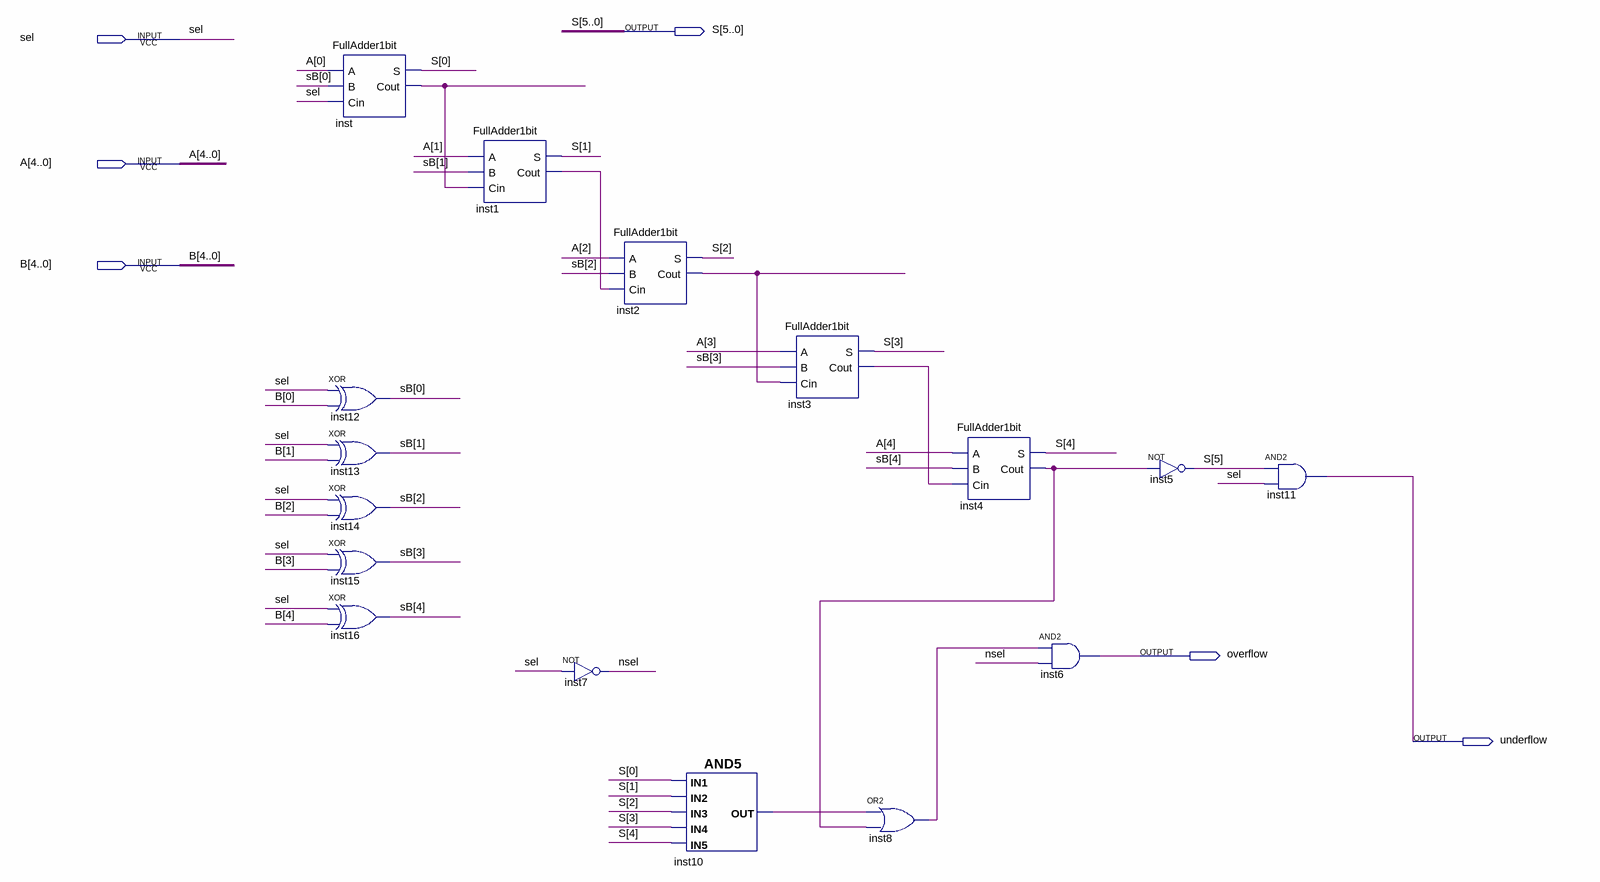
[diagram p0: schematic sheet]
// Quartus schematic add_sub5bit.bdf as structural Verilog: 16 symbols, 6 pins
module add_sub5bit (
  input  sel,
  input  [4:0] A,
  input  [4:0] B,
  output [5:0] S,
  output overflow,
  output underflow
);

  wire inst1_cout, inst2_cout, inst3_cout, inst4_cout, inst8_out, inst10_out, inst_cout, nsel;
  wire [4:0] sB;

  FullAdder1bit inst (.A(A[0]), .B(sB[0]), .Cin(sel), .S(S[0]), .Cout(inst_cout));
  xor inst12 (sB[0], sel, B[0]);
  xor inst13 (sB[1], sel, B[1]);
  xor inst14 (sB[2], sel, B[2]);
  xor inst15 (sB[3], sel, B[3]);
  xor inst16 (sB[4], sel, B[4]);
  FullAdder1bit inst1 (.A(A[1]), .B(sB[1]), .Cin(inst_cout), .S(S[1]), .Cout(inst1_cout));
  not inst7 (nsel, sel);
  FullAdder1bit inst2 (.A(A[2]), .B(sB[2]), .Cin(inst1_cout), .S(S[2]), .Cout(inst2_cout));
  and inst10 (inst10_out, S[0], S[1], S[2], S[3], S[4]);
  FullAdder1bit inst3 (.A(A[3]), .B(sB[3]), .Cin(inst2_cout), .S(S[3]), .Cout(inst3_cout));
  or inst8 (inst8_out, inst10_out, inst4_cout);
  FullAdder1bit inst4 (.A(A[4]), .B(sB[4]), .Cin(inst3_cout), .S(S[4]), .Cout(inst4_cout));
  and inst6 (overflow, inst8_out, nsel);
  not inst5 (S[5], inst4_cout);
  and inst11 (underflow, S[5], sel);
endmodule
